# Altium schematic sheet Main.SchDoc
size 127 x 88 mm
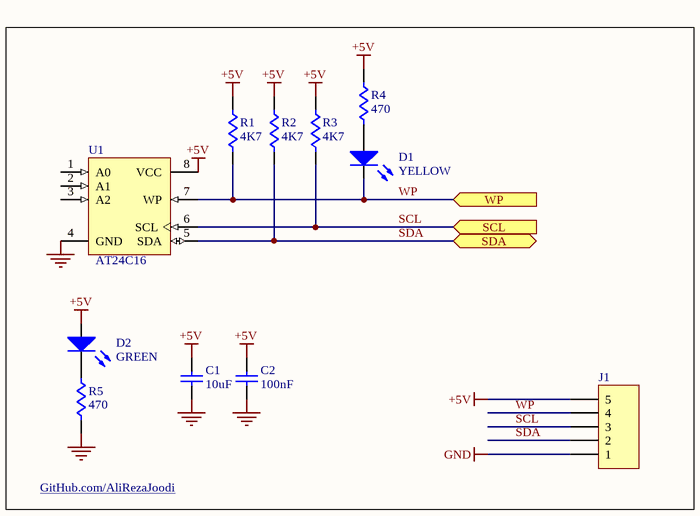
[diagram p0: Main.SchDoc]

## Parts
C1  10uF  [0805]
C2  100nF  [0805]
D1  YELLOW  [0805_Diode]
D2  GREEN  [0805_Diode]
J1  5PIN  [HDR1X5]  (value not drawn)
R1  4K7  [0805]
R2  4K7  [0805]
R3  4K7  [0805]
R4  470  [0805]
R5  470  [0805]
U1  AT24C16  [SOP127P636-8N]

## Ports
SCL (in), SDA, WP (in)

## Nets
+5V: C1.2 C2.2 D2.1(A) J1.5 R1.2 R2.2 R3.2 R4.1 U1.8(VCC)
GND: C1.1 C2.1 J1.1 R5.2 U1.4(GND)
SCL: J1.3 R3.1 U1.6(SCL) ; port SCL
SDA: J1.2 R2.1 U1.5(SDA) ; port SDA
WP: D1.2(K) J1.4 R1.1 U1.7(WP) ; port WP
NetD1_1: D1.1(A) R4.2
NetD2_2: D2.2(K) R5.1

Not connected (* = marked no-connect by the designer): U1 1(A0) 2(A1) 3(A2)

## Notes on the sheet
- GitHub.com/AliRezaJoodi

## Library data of the parts
C1 C2 = Cap: Capacitor; Manufacturer: Generic Components; Class I: Passive; Published: 8-Jun-2000; Revision: July-2002: Re-released for DXP Platform.; Publisher: Altium Limited; Class II: Capacitor
D1 D2 = LED: Typical INFRARED GaAs LED; Manufacturer: Generic Components; Class I: Optoelectronic; Published: 8-Jun-2000; Revision: July-2002: Re-released for DXP Platform.; Publisher: Altium Limited; Class II: LED
J1 = Header 5: Header, 5-Pin; Manufacturer: Generic Components; Class I: Connector; Revision: July-2002: Re-released for DXP Platform.; Publisher: Altium Limited
R1-R5 = Res1: Resistor; Manufacturer: Generic Components; Class I: Passive; Published: 8-Jun-2000; Revision: July-2002: Re-released for DXP Platform.; Publisher: Altium Limited; Class II: Resistor
U1 = AT24C01B-TP25-B: 1Kbit (128 x 8), 2-wire Bus Automotive Serial EEPROM with Write Protect, 2.5V, 8-Pin TSSOP, Bulk; Published: 20-Sep-2010; DatasheetVersion: 8517C,  Jan-2009; PackageVersion: revD, Dec-2009; PackageReference: 8A2; Publisher: Altium Limited; PackageDescription: 8-Lead, 4.4 mm Body, Plastic Thin Shrink Small Outline Package (TSSOP); Code_JEDEC: MO-153-AA; ComponentLink1Description: Manufacturer Link; ComponentLink1URL: http://www.atmel.com/products/serial/default.asp; ComponentLink2Description: Datasheet; ComponentLink2URL: http://www.atmel.com/dyn/resources/prod_documents/doc8517.pdf; ComponentLink3Description: Atmel.com Home; ComponentLink3URL: http://www.atmel.com